# Altium project PCB_Project.PrjPcb
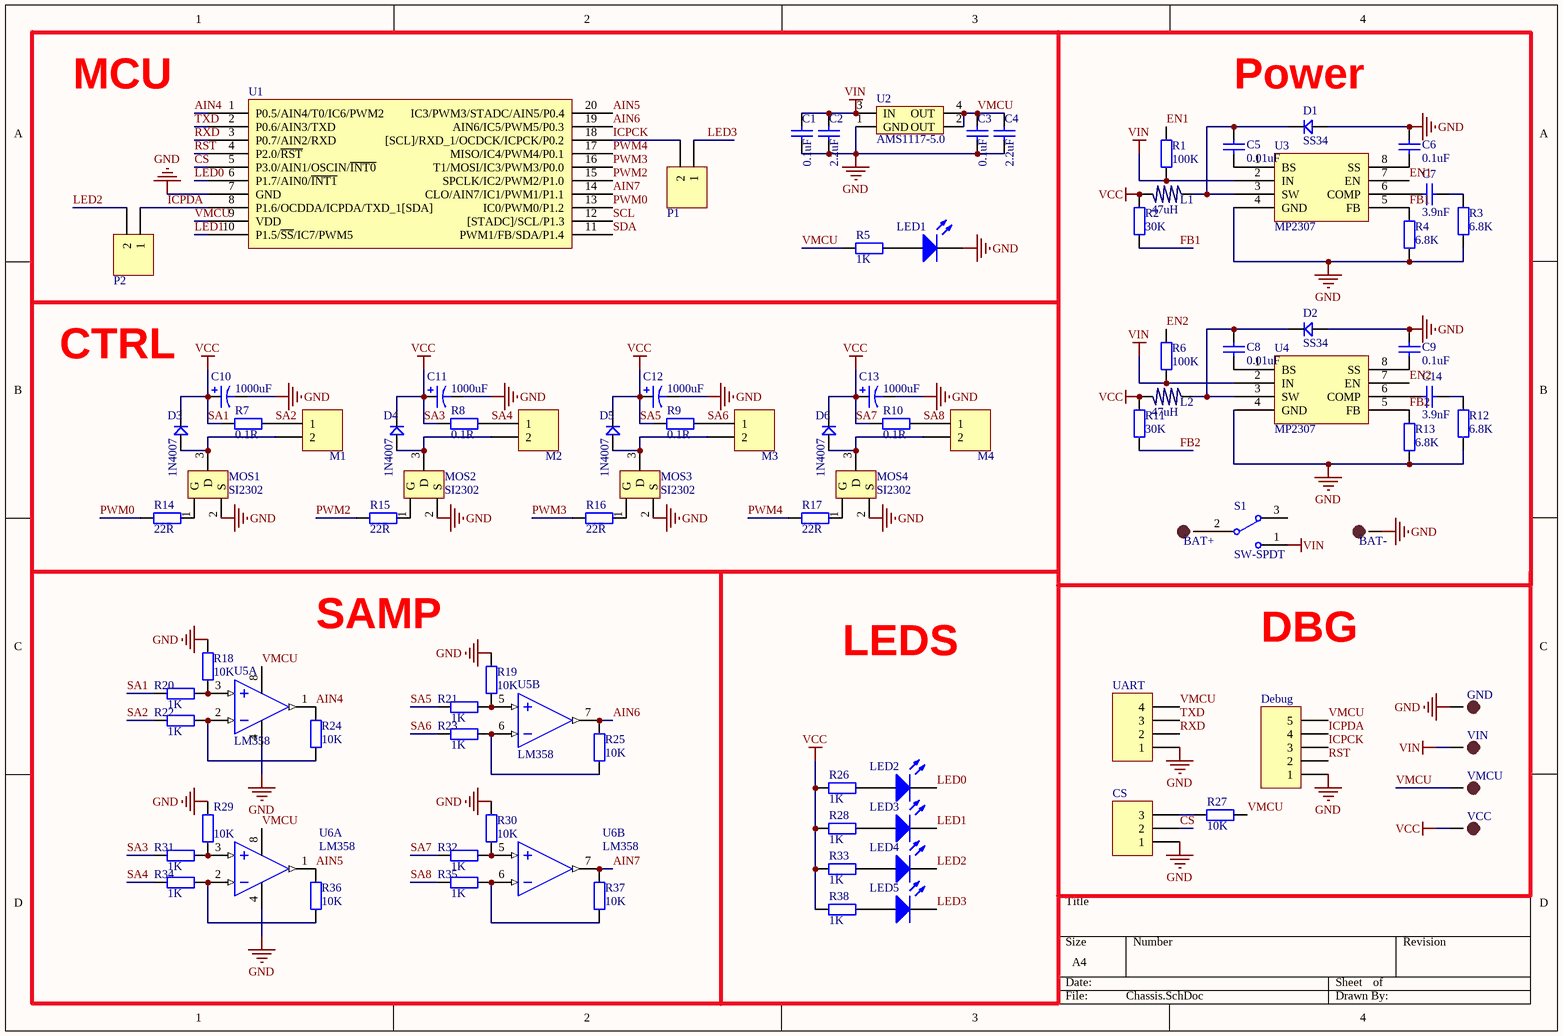
[diagram p0: Chassis.SchDoc]
1 sheet, 91 parts. Net scope: global (net labels, ports and power ports of the same name join across sheets).
Board file: PCB1.PcbDoc

## Sheet Chassis.SchDoc
size A4

### Parts
BAT+  SPK+  [TP-1.5]  (value not drawn)
BAT-  SPK+  [TP-1.5]  (value not drawn)
C1  value 0.1uF  [0603P]  (hidden comment: Cap)
C2  value 2.2uF  [0603P]  (hidden comment: Cap)
C3  value 0.1uF  [0603P]  (hidden comment: Cap)
C4  value 2.2uF  [0603P]  (hidden comment: Cap)
C5  value 0.01uF  [0603P]  (hidden comment: Cap)
C6  value 0.1uF  [0603P]  (hidden comment: Cap)
C7  value 3.9nF  [0603P]  (hidden comment: Cap)
C8  value 0.01uF  [0603P]  (hidden comment: Cap)
C9  value 0.1uF  [0603P]  (hidden comment: Cap)
C10  value 1000uF  [C-RB-5.0/13]  (hidden comment: Cap Pol1)
C11  value 1000uF  [C-RB-5.0/13]  (hidden comment: Cap Pol1)
C12  value 1000uF  [C-RB-5.0/13]  (hidden comment: Cap Pol1)
C13  value 1000uF  [C-RB-5.0/13]  (hidden comment: Cap Pol1)
C14  value 3.9nF  [0603P]  (hidden comment: Cap)
CS  Header 3  [HDR1X3]  (value not drawn)
D1  SS34  [SOD-123]
D2  SS34  [SOD-123]
D3  1N4007  [SOD-123]
D4  1N4007  [SOD-123]
D5  1N4007  [SOD-123]
D6  1N4007  [SOD-123]
Debug  Header 5  [HDR1X5]  (value not drawn)
GND  SPK+  [TP-1.5]  (value not drawn)
L1  47uH  [0603P]
L2  47uH  [0603P]
LED1  LED1  [LED-1206]  (value not drawn)
LED2  LED1  [LED-1206]  (value not drawn)
LED3  LED1  [LED-1206]  (value not drawn)
LED4  LED1  [LED-1206]  (value not drawn)
LED5  LED1  [LED-1206]  (value not drawn)
M1  Header 2  [HDR1X2]  (value not drawn)
M2  Header 2  [HDR1X2]  (value not drawn)
M3  Header 2  [HDR1X2]  (value not drawn)
M4  Header 2  [HDR1X2]  (value not drawn)
MOS1  SI2302  [SO-G3/C2.5]
MOS2  SI2302  [SO-G3/C2.5]
MOS3  SI2302  [SO-G3/C2.5]
MOS4  SI2302  [SO-G3/C2.5]
P1  Header 2  [HDR1X2]  (value not drawn)
P2  Header 2  [HDR1X2]  (value not drawn)
R1  value 100K  [0603P]  (hidden comment: Res2)
R2  value 30K  [0603P]  (hidden comment: Res2)
R3  value 6.8K  [0603P]  (hidden comment: Res2)
R4  value 6.8K  [0603P]  (hidden comment: Res2)
R5  value 1K  [0603P]  (hidden comment: Res2)
R6  value 100K  [0603P]  (hidden comment: Res2)
R7  value 0.1R  [2512]  (hidden comment: Res2)
R8  value 0.1R  [2512]  (hidden comment: Res2)
R9  value 0.1R  [2512]  (hidden comment: Res2)
R10  value 0.1R  [2512]  (hidden comment: Res2)
R11  value 30K  [0603p]  (hidden comment: Res2)
R12  value 6.8K  [0603p]  (hidden comment: Res2)
R13  value 6.8K  [0603p]  (hidden comment: Res2)
R14  value 22R  [0603p]  (hidden comment: Res2)
R15  value 22R  [0603p]  (hidden comment: Res2)
R16  value 22R  [0603p]  (hidden comment: Res2)
R17  value 22R  [0603p]  (hidden comment: Res2)
R18  value 10K  [0603p]  (hidden comment: Res2)
R19  value 10K  [0603p]  (hidden comment: Res2)
R20  value 1K  [0603p]  (hidden comment: Res2)
R21  value 1K  [0603p]  (hidden comment: Res2)
R22  value 1K  [0603p]  (hidden comment: Res2)
R23  value 1K  [0603p]  (hidden comment: Res2)
R24  value 10K  [0603p]  (hidden comment: Res2)
R25  value 10K  [0603p]  (hidden comment: Res2)
R26  value 1K  [0603p]  (hidden comment: Res2)
R27  value 10K  [0603p]  (hidden comment: Res2)
R28  value 1K  [0603p]  (hidden comment: Res2)
R29  value 10K  [0603p]  (hidden comment: Res2)
R30  value 10K  [0603p]  (hidden comment: Res2)
R31  value 1K  [0603p]  (hidden comment: Res2)
R32  value 1K  [0603p]  (hidden comment: Res2)
R33  value 1K  [0603p]  (hidden comment: Res2)
R34  value 1K  [0603p]  (hidden comment: Res2)
R35  value 1K  [0603p]  (hidden comment: Res2)
R36  value 10K  [0603p]  (hidden comment: Res2)
R37  value 10K  [0603p]  (hidden comment: Res2)
R38  value 1K  [0603p]  (hidden comment: Res2)
S1  SW-SPDT  [SWITCH_A3]
U1  N76E003  [SSOP-20_208mil]  (value not drawn)
U2  AMS1117-5.0  [AMS1117]
U3  MP2307  [SOP-8]
U4  MP2307  [SOP-8]
U5  LM358  [SOIC-8]  (parts A,B of 2)
U6  LM358  [SOIC-8]  (parts A,B of 2)
UART  Header 4  [HDR1X4]  (value not drawn)
VCC  SPK+  [TP-1.5]  (value not drawn)
VIN  SPK+  [TP-1.5]  (value not drawn)
VMCU  SPK+  [TP-1.5]  (value not drawn)

### Nets
GND: BAT-.1 C1.1 C2.1 C3.1 C4.1 C6.2 C9.2 C10.2 C11.2 C12.2 C13.2 CS.1 D1.1 D2.1 Debug.1 GND.1 LED1.2(K) MOS1.2(S) MOS2.2(S) MOS3.2(S) MOS4.2(S) R3.1 R4.1 R12.1 R13.1 R18.2 R19.2 R29.2 R30.2 U1.7(GND) U2.1(GND) U3.4(GND) U4.4(GND) U5.4(V-) U6.4(V-) UART.1
SA1: C10.1 C11.1 C12.1 C13.1 D3.2 D4.2 D5.2 D6.2 L1.2 L2.2 R2.2 R7.1 R8.1 R9.1 R10.1 R11.2 R20.1 R21.1 R26.1 R28.1 R31.1 R32.1 R33.1 R38.1 VCC.1  [also labelled SA3, SA5, SA7, VCC]
VIN: C1.2 C2.2 R1.1 R6.1 S1.1 U2.3(IN) U3.2(IN) U4.2(IN) VIN.1
AIN4: R24.2 U1.1(P0.5/AIN4/T0/IC6/PWM2) U5.1(OUT)
AIN5: R36.2 U1.20(IC3/PWM3/STADC/AIN5/P0.4) U6.1(OUT)
AIN6: R25.2 U1.19(AIN6/IC5/PWM5/P0.3) U5.7(OUT)
AIN7: R37.2 U1.14(CLO/AIN7/IC1/PWM1/P1.1) U6.7(OUT)
CS: CS.2 U1.5(P3.0/AIN1/OSCIN/~{INT0})
EN1: R1.2 U3.7(EN)
EN2: R6.2 U4.7(EN)
FB1: R2.1 R4.2 U3.5(FB)
FB2: R11.1 R13.2 U4.5(FB)
ICPCK: Debug.3 P1.2 U1.18([SCL]/RXD_1/OCDCK/ICPCK/P0.2)
ICPDA: Debug.4 P2.1 U1.8(P1.6/OCDDA/ICPDA/TXD_1[SDA])
LED0: LED2.2(K) U1.6(P1.7/AIN0/~{INT1})
LED1: LED3.2(K) U1.10(P1.5/~{SS}/IC7/PWM5)
LED2: LED4.2(K) P2.2
LED3: LED5.2(K) P1.1
PWM0: R14.1 U1.13(IC0/PWM0/P1.2)
PWM2: R15.1 U1.15(SPCLK/IC2/PWM2/P1.0)
PWM3: R16.1 U1.16(T1/MOSI/IC3/PWM3/P0.0)
PWM4: R17.1 U1.17(MISO/IC4/PWM4/P0.1)
RST: Debug.2 U1.4(P2.0/~{RST})
RXD: U1.3(P0.7/AIN2/RXD) UART.2
SA2: M1.1 R7.2 R22.1
SA4: M2.1 R8.2 R34.1
SA6: M3.1 R9.2 R23.1
SA8: M4.1 R10.2 R35.1
SCL: U1.12([STADC]/SCL/P1.3)
SDA: U1.11(PWM1/FB/SDA/P1.4)
TXD: U1.2(P0.6/AIN3/TXD) UART.3
VMCU: C3.2 C4.2 Debug.5 R5.1 R27.2 U1.9(VDD) U2.2(OUT) U2.4(OUT) U5.8(V+) U6.8(V+) UART.4 VMCU.1
NetBAT+_1: BAT+.1 S1.2
NetC5_1: C5.1 U3.1(BS)
NetC5_2: C5.2 D1.2 L1.1 U3.3(SW)
NetC6_1: C6.1 U3.8(SS)
NetC7_1: C7.1 R3.2
NetC7_2: C7.2 U3.6(COMP)
NetC8_1: C8.1 U4.1(BS)
NetC8_2: C8.2 D2.2 L2.1 U4.3(SW)
NetC9_1: C9.1 U4.8(SS)
NetC14_1: C14.1 R12.2
NetC14_2: C14.2 U4.6(COMP)
NetCS_3: CS.3 R27.1
NetD3_1: D3.1 M1.2 MOS1.3(D)
NetD4_1: D4.1 M2.2 MOS2.3(D)
NetD5_1: D5.1 M3.2 MOS3.3(D)
NetD6_1: D6.1 M4.2 MOS4.3(D)
NetLED1_1: LED1.1(A) R5.2
NetLED2_1: LED2.1(A) R26.2
NetLED3_1: LED3.1(A) R28.2
NetLED4_1: LED4.1(A) R33.2
NetLED5_1: LED5.1(A) R38.2
NetMOS1_1: MOS1.1(G) R14.2
NetMOS2_1: MOS2.1(G) R15.2
NetMOS3_1: MOS3.1(G) R16.2
NetMOS4_1: MOS4.1(G) R17.2
NetR18_1: R18.1 R20.2 U5.3(IN+)
NetR19_1: R19.1 R21.2 U5.5(IN+)
NetR22_2: R22.2 R24.1 U5.2(IN-)
NetR23_2: R23.2 R25.1 U5.6(IN-)
NetR29_1: R29.1 R31.2 U6.3(IN+)
NetR30_1: R30.1 R32.2 U6.5(IN+)
NetR34_2: R34.2 R36.1 U6.2(IN-)
NetR35_2: R35.2 R37.1 U6.6(IN-)

Not connected (* = marked no-connect by the designer): S1 3

### Notes on the sheet
- MCU
- Power
- CTRL
- SAMP
- DBG
- LEDS

### Library data of the parts
BAT+ BAT- GND VCC VIN VMCU = TEST-POINT: 测试点
C1-C9 C14 = Cap: Capacitor; Published: 8-Jun-2000; LatestRevisionDate: 17-Jul-2002; LatestRevisionNote: Re-released for DXP Platform.; PackageReference: RAD-0.3; Publisher: Altium Limited; PackageDescription: Radial Cap, Thru-Hole; 2 Leads; 0.3 in Pin Spacing
C10-C13 = Cap Pol1: Polarized Capacitor (Radial); Published: 8-Jun-2000; LatestRevisionDate: 17-Jul-2002; LatestRevisionNote: Re-released for DXP Platform.; PackageReference: RB7.6-15; Publisher: Altium Limited; PackageDescription: Polarized Capacitor (Radial); 2 Leads
CS = Header 3: Header, 3-Pin; LatestRevisionDate: 17-Jul-2002; LatestRevisionNote: Re-released for DXP Platform.; Publisher: Altium Limited
D1-D6 = D
Debug = Header 5: Header, 5-Pin; LatestRevisionDate: 17-Jul-2002; LatestRevisionNote: Re-released for DXP Platform.; Publisher: Altium Limited
L1 L2 = L
LED1-LED5 = LED2: Typical RED, GREEN, YELLOW, AMBER GaAs LED; Published: 8-Jun-2000; LatestRevisionDate: 17-Jul-2002; LatestRevisionNote: Re-released for DXP Platform.; PackageDocument: Feb-2002; PackageReference: 3.2X1.6X1.1; Publisher: Altium Limited
M1-M4 P1 P2 = Header 2: Header, 2-Pin; LatestRevisionDate: 17-Jul-2002; LatestRevisionNote: Re-released for DXP Platform.; Publisher: Altium Limited
MOS1-MOS4 = MOS-P: IRLML6401/SI2301
R1-R38 = Res2: Resistor; Published: 8-Jun-2000; LatestRevisionDate: 17-Jul-2002; LatestRevisionNote: Re-released for DXP Platform.; PackageReference: AXIAL-0.4; Publisher: Altium Limited; PackageDescription: Axial Device, Thru-Hole; 2 Leads; 0.4 in Pin Spacing
S1 = SW-SPDT: 开关; Published: 24-Mar-1999; LatestRevisionDate: 17-Dec-2003; LatestRevisionNote: Schematic revised, PCB Footprint replaced.; DatasheetDocument: 05-Dec-2000; PackageReference: TL36WW15050; Publisher: Altium Limited; ComponentLink1Description: Manufacturer Link; ComponentLink1URL: http://www.apem.com
U2 = AMS1117
U5 U6 = LM358: 双运放
UART = Header 4: Header, 4-Pin; LatestRevisionDate: 17-Jul-2002; LatestRevisionNote: Re-released for DXP Platform.; Publisher: Altium Limited